# Altium schematic sheet Top.SchDoc
size A4
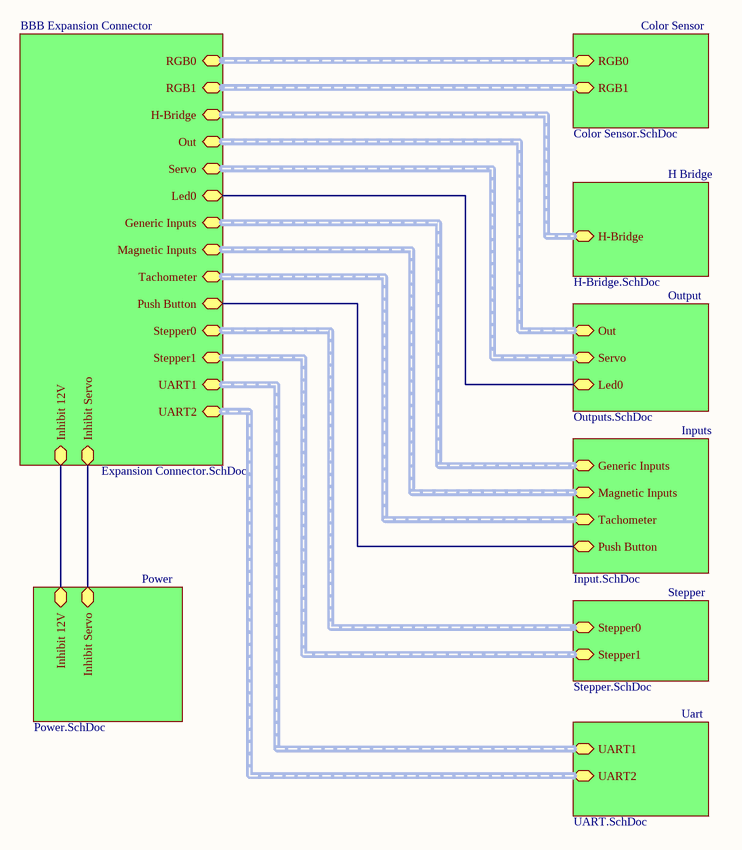
[diagram p0: Top.SchDoc]

## Sub-sheets
BBB Expansion Connector = Expansion Connector.SchDoc: Out (harness Outputs), Generic Inputs (harness Generic Inputs), RGB0 (harness RGB), H-Bridge (harness H-Bridge), RGB1 (harness RGB), Stepper0 (harness Stepper), Stepper1 (harness Stepper), Servo (harness Servo), Magnetic Inputs (harness Magnetic Inputs), Inhibit 12V, Inhibit Servo, Push Button, Tachometer (harness Tachometer), Led0, UART1 (harness Serial), UART2 (harness Serial)
Color Sensor = Color Sensor.SchDoc: RGB0 (harness RGB), RGB1 (harness RGB)
H Bridge = H-Bridge.SchDoc: H-Bridge (harness H-Bridge)
Inputs = Input.SchDoc: Generic Inputs (harness Generic Inputs), Magnetic Inputs (harness Magnetic Inputs), Push Button, Tachometer (harness Tachometer)
Output = Outputs.SchDoc: Out (harness Outputs), Servo (harness Servo), Led0
Power = Power.SchDoc: Inhibit 12V, Inhibit Servo
Stepper = Stepper.SchDoc: Stepper0 (harness Stepper), Stepper1 (harness Stepper)
Uart = UART.SchDoc: UART1 (harness Serial), UART2 (harness Serial)

## Nets
(unnamed): sheet BBB Expansion Connector/Inhibit 12V, sheet Power/Inhibit 12V
(unnamed): sheet BBB Expansion Connector/Inhibit Servo, sheet Power/Inhibit Servo
(unnamed): sheet BBB Expansion Connector/Push Button, sheet Inputs/Push Button
(unnamed): sheet BBB Expansion Connector/Led0, sheet Output/Led0

## Buses and harness runs
harness sheet BBB Expansion Connector/Generic Inputs = sheet Inputs/Generic Inputs
harness sheet BBB Expansion Connector/H-Bridge = sheet H Bridge/H-Bridge
harness sheet BBB Expansion Connector/Magnetic Inputs = sheet Inputs/Magnetic Inputs
harness sheet BBB Expansion Connector/Out = sheet Output/Out
harness sheet BBB Expansion Connector/RGB0 = sheet Color Sensor/RGB0
harness sheet BBB Expansion Connector/RGB1 = sheet Color Sensor/RGB1
harness sheet BBB Expansion Connector/Servo = sheet Output/Servo
harness sheet BBB Expansion Connector/Stepper0 = sheet Stepper/Stepper0
harness sheet BBB Expansion Connector/Stepper1 = sheet Stepper/Stepper1
harness sheet BBB Expansion Connector/Tachometer = sheet Inputs/Tachometer
harness sheet BBB Expansion Connector/UART1 = sheet Uart/UART1
harness sheet BBB Expansion Connector/UART2 = sheet Uart/UART2